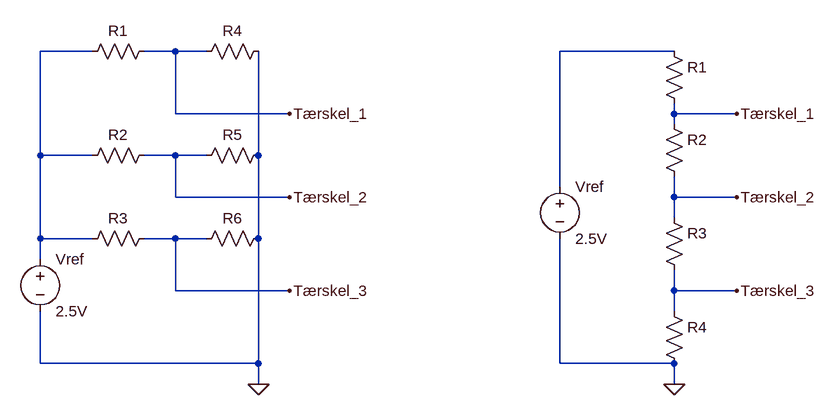
[diagram p0: schematic Eksempel_Spændingstræ.asc]
Eksempel_Spændingstræ.asc, the LTspice schematic file:
Version 4
SHEET 1 880 680
WIRE -544 -256 -624 -256
WIRE -416 -256 -464 -256
WIRE -368 -256 -416 -256
WIRE 352 -256 176 -256
WIRE -416 -160 -416 -256
WIRE -240 -160 -416 -160
WIRE 352 -160 352 -176
WIRE 448 -160 352 -160
WIRE 352 -144 352 -160
WIRE -624 -96 -624 -256
WIRE -544 -96 -624 -96
WIRE -416 -96 -464 -96
WIRE -368 -96 -416 -96
WIRE -288 -96 -288 -256
WIRE 176 -48 176 -256
WIRE -416 -32 -416 -96
WIRE -240 -32 -416 -32
WIRE 352 -32 352 -64
WIRE 448 -32 352 -32
WIRE 352 0 352 -32
WIRE -624 32 -624 -96
WIRE -544 32 -624 32
WIRE -416 32 -464 32
WIRE -368 32 -416 32
WIRE -288 32 -288 -96
WIRE -624 64 -624 32
WIRE -416 112 -416 32
WIRE -240 112 -416 112
WIRE 352 112 352 80
WIRE 448 112 352 112
WIRE 352 144 352 112
WIRE -624 224 -624 144
WIRE -288 224 -288 32
WIRE -288 224 -624 224
WIRE 176 224 176 32
WIRE 352 224 176 224
WIRE -288 256 -288 224
WIRE 352 256 352 224
FLAG 352 256 0
FLAG 448 -160 Tærskel_1
FLAG 448 -32 Tærskel_2
FLAG 448 112 Tærskel_3
FLAG -288 256 0
FLAG -240 -160 Tærskel_1
FLAG -240 -32 Tærskel_2
FLAG -240 112 Tærskel_3
SYMBOL voltage 176 -64 R0
SYMATTR InstName Vref
SYMATTR Value 2.5V
SYMBOL res 336 -272 R0
SYMATTR InstName R1
SYMATTR Value ""
SYMBOL res 336 -160 R0
SYMATTR InstName R2
SYMATTR Value ""
SYMBOL res 336 -16 R0
SYMATTR InstName R3
SYMATTR Value ""
SYMBOL res 336 128 R0
SYMATTR InstName R4
SYMATTR Value ""
SYMBOL voltage -624 48 R0
SYMATTR InstName Vref
SYMATTR Value 2.5V
SYMBOL res -448 -272 R90
WINDOW 0 0 56 VBottom 2
WINDOW 3 32 56 VTop 2
SYMATTR InstName R1
SYMATTR Value ""
SYMBOL res -272 -272 R90
WINDOW 0 0 56 VBottom 2
WINDOW 3 32 56 VTop 2
SYMATTR InstName R4
SYMATTR Value ""
SYMBOL res -448 -112 R90
WINDOW 0 0 56 VBottom 2
WINDOW 3 32 56 VTop 2
SYMATTR InstName R2
SYMATTR Value ""
SYMBOL res -272 -112 R90
WINDOW 0 0 56 VBottom 2
WINDOW 3 32 56 VTop 2
SYMATTR InstName R5
SYMATTR Value ""
SYMBOL res -448 16 R90
WINDOW 0 0 56 VBottom 2
WINDOW 3 32 56 VTop 2
SYMATTR InstName R3
SYMATTR Value ""
SYMBOL res -272 16 R90
WINDOW 0 0 56 VBottom 2
WINDOW 3 32 56 VTop 2
SYMATTR InstName R6
SYMATTR Value ""

The netlist it stands for:
* Eksempel_Spændingstræ.asc
Vref N002 0 2.5V
R1 N002 Tærskel_1
R2 Tærskel_1 Tærskel_2
R3 Tærskel_2 Tærskel_3
R4 Tærskel_3 0
Vref N001 0 2.5V
R1 Tærskel_1 N001
R4 0 Tærskel_1
R2 Tærskel_2 N001
R5 0 Tærskel_2
R3 Tærskel_3 N001
R6 0 Tærskel_3
.backanno
.end